# EAGLE design Dist (EAGLE 6.2)
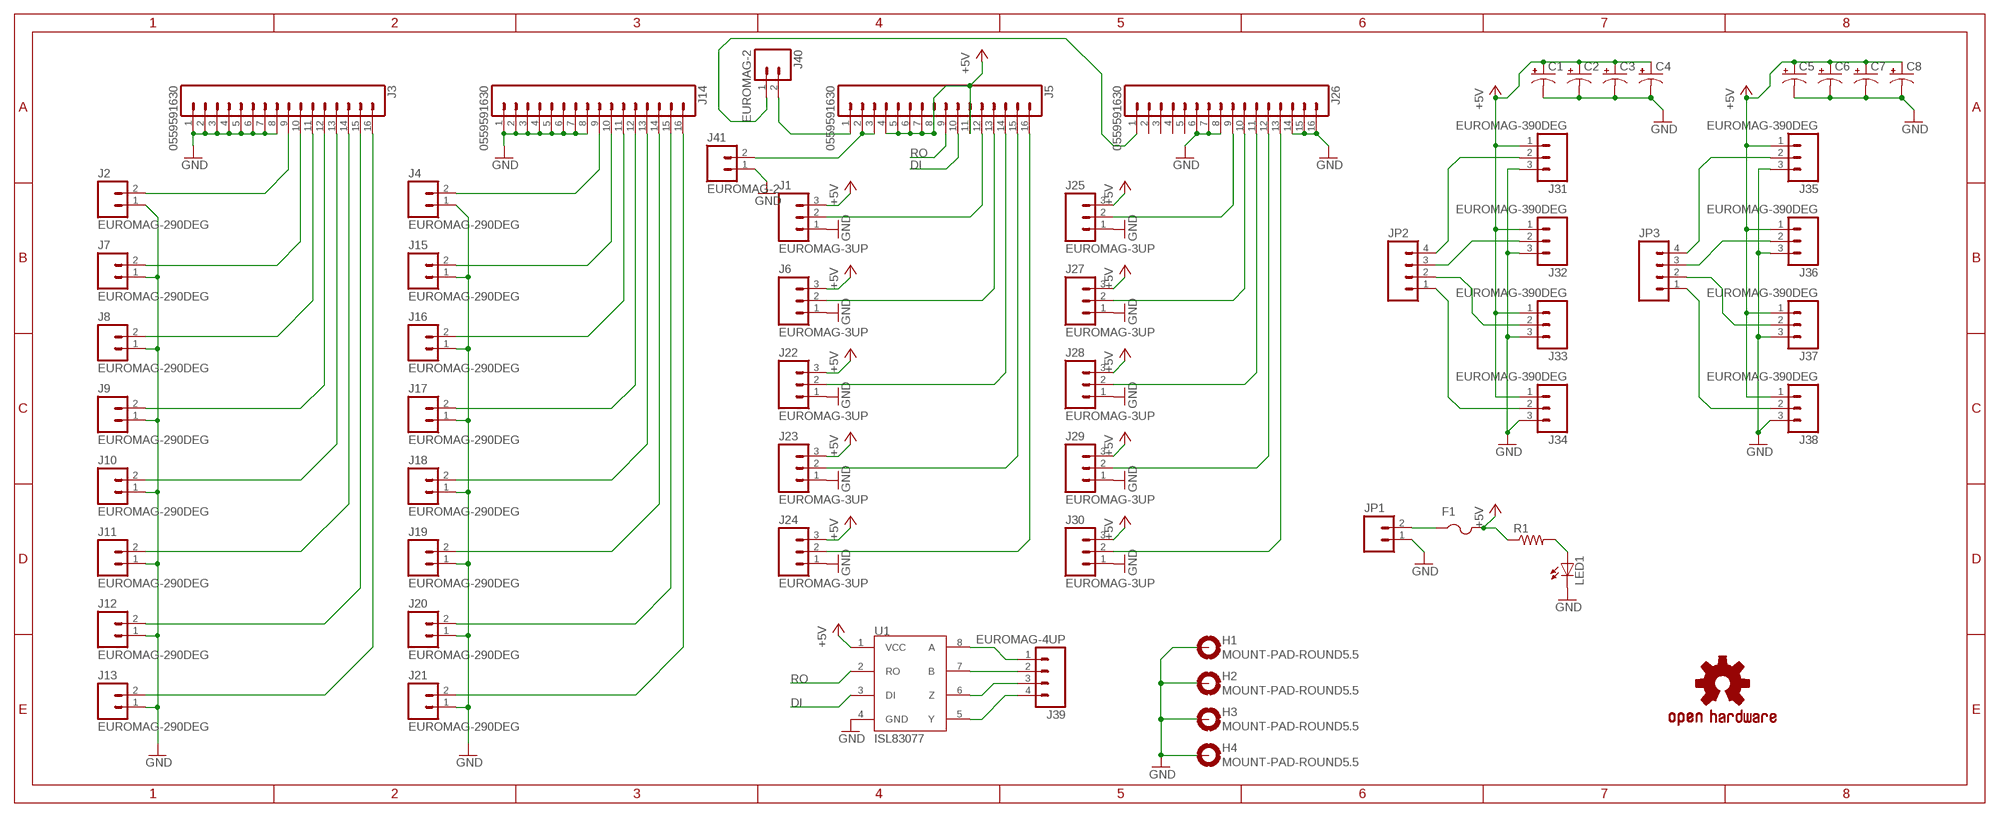
[diagram p0: schematic, sheet 1]

## Parts
C1  CAP_POL3528  [EIA3528]
C2  CAP_POL3528  [EIA3528]
C3  CAP_POL3528  [EIA3528]
C4  CAP_POL3528  [EIA3528]
C5  CAP_POL3528  [EIA3528]
C6  CAP_POL3528  [EIA3528]
C7  CAP_POL3528  [EIA3528]
C8  CAP_POL3528  [EIA3528]
F1  PTCFUSE-1812  [1812]
H1  MOUNT-PAD-ROUND5.5  [5,5-PAD]
H2  MOUNT-PAD-ROUND5.5  [5,5-PAD]
H3  MOUNT-PAD-ROUND5.5  [5,5-PAD]
H4  MOUNT-PAD-ROUND5.5  [5,5-PAD]
J1  EUROMAG-3UP  [M3-UP]
J2  EUROMAG-290DEG  [M2]
J3  0559591630  [0559591630]
J4  EUROMAG-290DEG  [M2]
J5  0559591630  [0559591630]
J6  EUROMAG-3UP  [M3-UP]
J7  EUROMAG-290DEG  [M2]
J8  EUROMAG-290DEG  [M2]
J9  EUROMAG-290DEG  [M2]
J10  EUROMAG-290DEG  [M2]
J11  EUROMAG-290DEG  [M2]
J12  EUROMAG-290DEG  [M2]
J13  EUROMAG-290DEG  [M2]
J14  0559591630  [0559591630]
J15  EUROMAG-290DEG  [M2]
J16  EUROMAG-290DEG  [M2]
J17  EUROMAG-290DEG  [M2]
J18  EUROMAG-290DEG  [M2]
J19  EUROMAG-290DEG  [M2]
J20  EUROMAG-290DEG  [M2]
J21  EUROMAG-290DEG  [M2]
J22  EUROMAG-3UP  [M3-UP]
J23  EUROMAG-3UP  [M3-UP]
J24  EUROMAG-3UP  [M3-UP]
J25  EUROMAG-3UP  [M3-UP]
J26  0559591630  [0559591630]
J27  EUROMAG-3UP  [M3-UP]
J28  EUROMAG-3UP  [M3-UP]
J29  EUROMAG-3UP  [M3-UP]
J30  EUROMAG-3UP  [M3-UP]
J31  EUROMAG-390DEG  [M3]
J32  EUROMAG-390DEG  [M3]
J33  EUROMAG-390DEG  [M3]
J34  EUROMAG-390DEG  [M3]
J35  EUROMAG-390DEG  [M3]
J36  EUROMAG-390DEG  [M3]
J37  EUROMAG-390DEG  [M3]
J38  EUROMAG-390DEG  [M3]
J39  EUROMAG-4UP  [M4-90]
J40  EUROMAG-2  [M2-UP]
J41  EUROMAG-2  [M2-UP]
JP1  M02POLAR_LOCK  [MOLEX-1X2_LOCK]
JP2  M04POLAR_LOCK  [MOLEX-1X4_LOCK]
JP3  M04POLAR_LOCK  [MOLEX-1X4_LOCK]
LED1  LEDCHIPLED_0805  [CHIPLED_0805]
R1  R-US_R0805  [R0805]
U1  ISL83077  [SO08]
U$1  OSHW-LOGOL  [OSHW-LOGO-L]

## Nets
+5V: C1.A(+) C2.A(+) C3.A(+) C4.A(+) C5.A(+) C6.A(+) C7.A(+) C8.A(+) F1.2 J1.3 J5.4 J5.5 J5.6 J5.7 J5.8 J5.11 J6.3 J22.3 J23.3 J24.3 J25.3 J27.3 J28.3 J29.3 J30.3 J31.1 J32.1 J33.1 J34.1 J35.1 J36.1 J37.1 J38.1 R1.1 U1.1(VCC)
DI: J5.10 U1.3(DI)
GND: C1.C(-) C2.C(-) C3.C(-) C4.C(-) C5.C(-) C6.C(-) C7.C(-) C8.C(-) H1.B5,5(MOUNT) H2.B5,5(MOUNT) H3.B5,5(MOUNT) H4.B5,5(MOUNT) J1.1 J2.1 J3.1 J3.2 J3.3 J3.4 J3.5 J3.6 J3.7 J3.8 J4.1 J6.1 J7.1 J8.1 J9.1 J10.1 J11.1 J12.1 J13.1 J14.1 J14.2 J14.3 J14.4 J14.5 J14.6 J14.7 J14.8 J15.1 J16.1 J17.1 J18.1 J19.1 J20.1 J21.1 J22.1 J23.1 J24.1 J25.1 J26.6 J26.7 J26.8 J26.14 J26.15 J26.16 J27.1 J28.1 J29.1 J30.1 J31.3 J32.3 J33.3 J34.3 J35.3 J36.3 J37.3 J38.3 J41.1 JP1.1 LED1.C U1.4(GND)
N$1: J2.2 J3.9
N$2: J3.10 J7.2
N$3: J3.11 J8.2
N$4: J3.12 J9.2
N$5: J3.13 J10.2
N$6: J3.14 J11.2
N$7: J3.15 J12.2
N$8: J3.16 J13.2
N$9: J25.2 J26.9
N$10: J4.2 J14.9
N$11: J14.10 J15.2
N$12: J14.11 J16.2
N$13: J14.12 J17.2
N$14: J14.13 J18.2
N$15: J14.14 J19.2
N$16: J14.15 J20.2
N$17: J14.16 J21.2
N$18: J26.10 J27.2
N$19: J26.11 J28.2
N$20: J26.12 J29.2
N$21: J26.13 J30.2
N$23: J1.2 J5.12
N$24: J5.13 J6.2
N$25: J5.14 J22.2
N$26: J5.15 J23.2
N$27: J5.16 J24.2
N$29: J5.2 J5.3 J41.2
N$30: J5.1 J40.2
N$31: J26.1 J40.1
N$32: J39.1 U1.8(A)
N$33: J39.2 U1.7(B)
N$34: J39.3 U1.6(Z)
N$35: J39.4 U1.5(Y)
N$47: J31.2 JP2.4
N$48: J32.2 JP2.3
N$49: J33.2 JP2.2
N$50: J34.2 JP2.1
N$51: F1.1 JP1.2
N$52: J35.2 JP3.4
N$53: J36.2 JP3.3
N$54: J37.2 JP3.2
N$55: J38.2 JP3.1
N$56: LED1.A R1.2
RO: J5.9 U1.2(RO)
Unconnected: J26.2 J26.3 J26.4 J26.5

## Library data of the parts
C1-C8 = SparkFun:CAP_POL: Capacitor Polarized These are standard SMD and PTH capacitors. Normally 10uF, 47uF, and 100uF in electrolytic and tantalum varieties. Always verify the external diameter of the through hole cap, it varies with capacity, voltage, and manufacturer. The EIA devices should be standard.
F1 = adafruit:PTCFUSE: PTC fuses, resettable thermistors
H1-H4 = holes:MOUNT-PAD-ROUND: MOUNTING PAD, round
J1 J6 J22-J25 J27-J38 = NASA_LIB:EUROMAG-3
J2 J4 J7-J13 J15-J21 J40 J41 = NASA_LIB:EUROMAG-2
J3 J5 J14 J26 = NASA_LIB:0559591630
J39 = NASA_LIB:EUROMAG-4
JP1 = SparkFun:M02: Header 2 Standard 2-pin 0.1" header. Use with straight break away headers (SKU : PRT-00116), right angle break away headers (PRT-00553), swiss pins (PRT-00743), machine pins (PRT-00117), and female headers (PRT-00115). Molex polarized connector foot print use with SKU : PRT-08233 with associated crimp pins and housings.
JP2 JP3 = SparkFun:M04: Header 4 Standard 4-pin 0.1" header. Use with straight break away headers (SKU : PRT-00116), right angle break away headers (PRT-00553), swiss pins (PRT-00743), machine pins (PRT-00117), and female headers (PRT-00115). Molex polarized connector foot print use with SKU : PRT-08231 with associated crimp pins and housings. 1MM SMD Version SKU: PRT-10208
LED1 = adafruit:LED: LED OSRAM: - CHIPLED LG R971, LG N971, LY N971, LG Q971, LY Q971, LO R971, LY R971 LH N974, LH R974 LS Q976, LO Q976, LY Q976 LO Q996 - Hyper CHIPLED LW Q18S LB Q993, LB Q99A, LB R99A - SideLED LS A670, LO A670, LY A670, LG A670, LP A670 LB A673, LV A673, LT A673, LW A673 LH A674 LY A675 LS A676, LA A676, LO A676, LY A676, LW A676 LS A679, LY A679, LG A679 - Hyper Micro SIDELED® LS Y876, LA Y876, LO Y876, LY Y876 LT Y87S - SmartLED LW L88C, LW L88S LB L89C, LB L89S, LG L890 LS L89K, LO L89K, LY L89K LS L896, LA L896, LO L896, LY L896 - TOPLED LS T670, LO T670, LY T670, LG T670, LP T670 LSG T670, LSP T670, LSY T670, LOP T670, LYG T670 LG T671, LOG T671, LSG T671 LB T673, LV T673, LT T673, LW T673 LH T674 LS T676, LA T676, LO T676, LY T676, LB T676, LH T676, LSB T676, LW T676 LB T67C, LV T67C, LT T67C, LS T67K, LO T67K, LY T67K, LW E67C LS E67B, LA E67B, LO E67B, LY E67B, LB E67C, LV E67C, LT E67C LW T67C LS T679, LY T679, LG T679 LS T770, LO T770, LY T770, LG T770, LP T770 LB T773, LV T773, LT T773, LW T773 LH T774 LS E675, LA E675, LY E675, LS T675 LS T776, LA T776, LO T776, LY T776, LB T776 LHGB T686 LT T68C, LB T68C - Hyper Mini TOPLED® LB M676 - Mini TOPLED Santana® LG M470 LS M47K, LO M47K, LY M47K Source: http://www.osram.convergy.de/
R1 = adafruit:R-US_: RESISTOR, American symbol
U1 = NASA_LIB:ISL83077
U$1 = SparkFun:OSHW-LOGO: Open Source Hardware Logo This logo indicates the piece of hardware it is found on incorporates a OSHW license and/or adheres to the definition of open source hardware found here: http://freedomdefined.org/OSHW

## Board
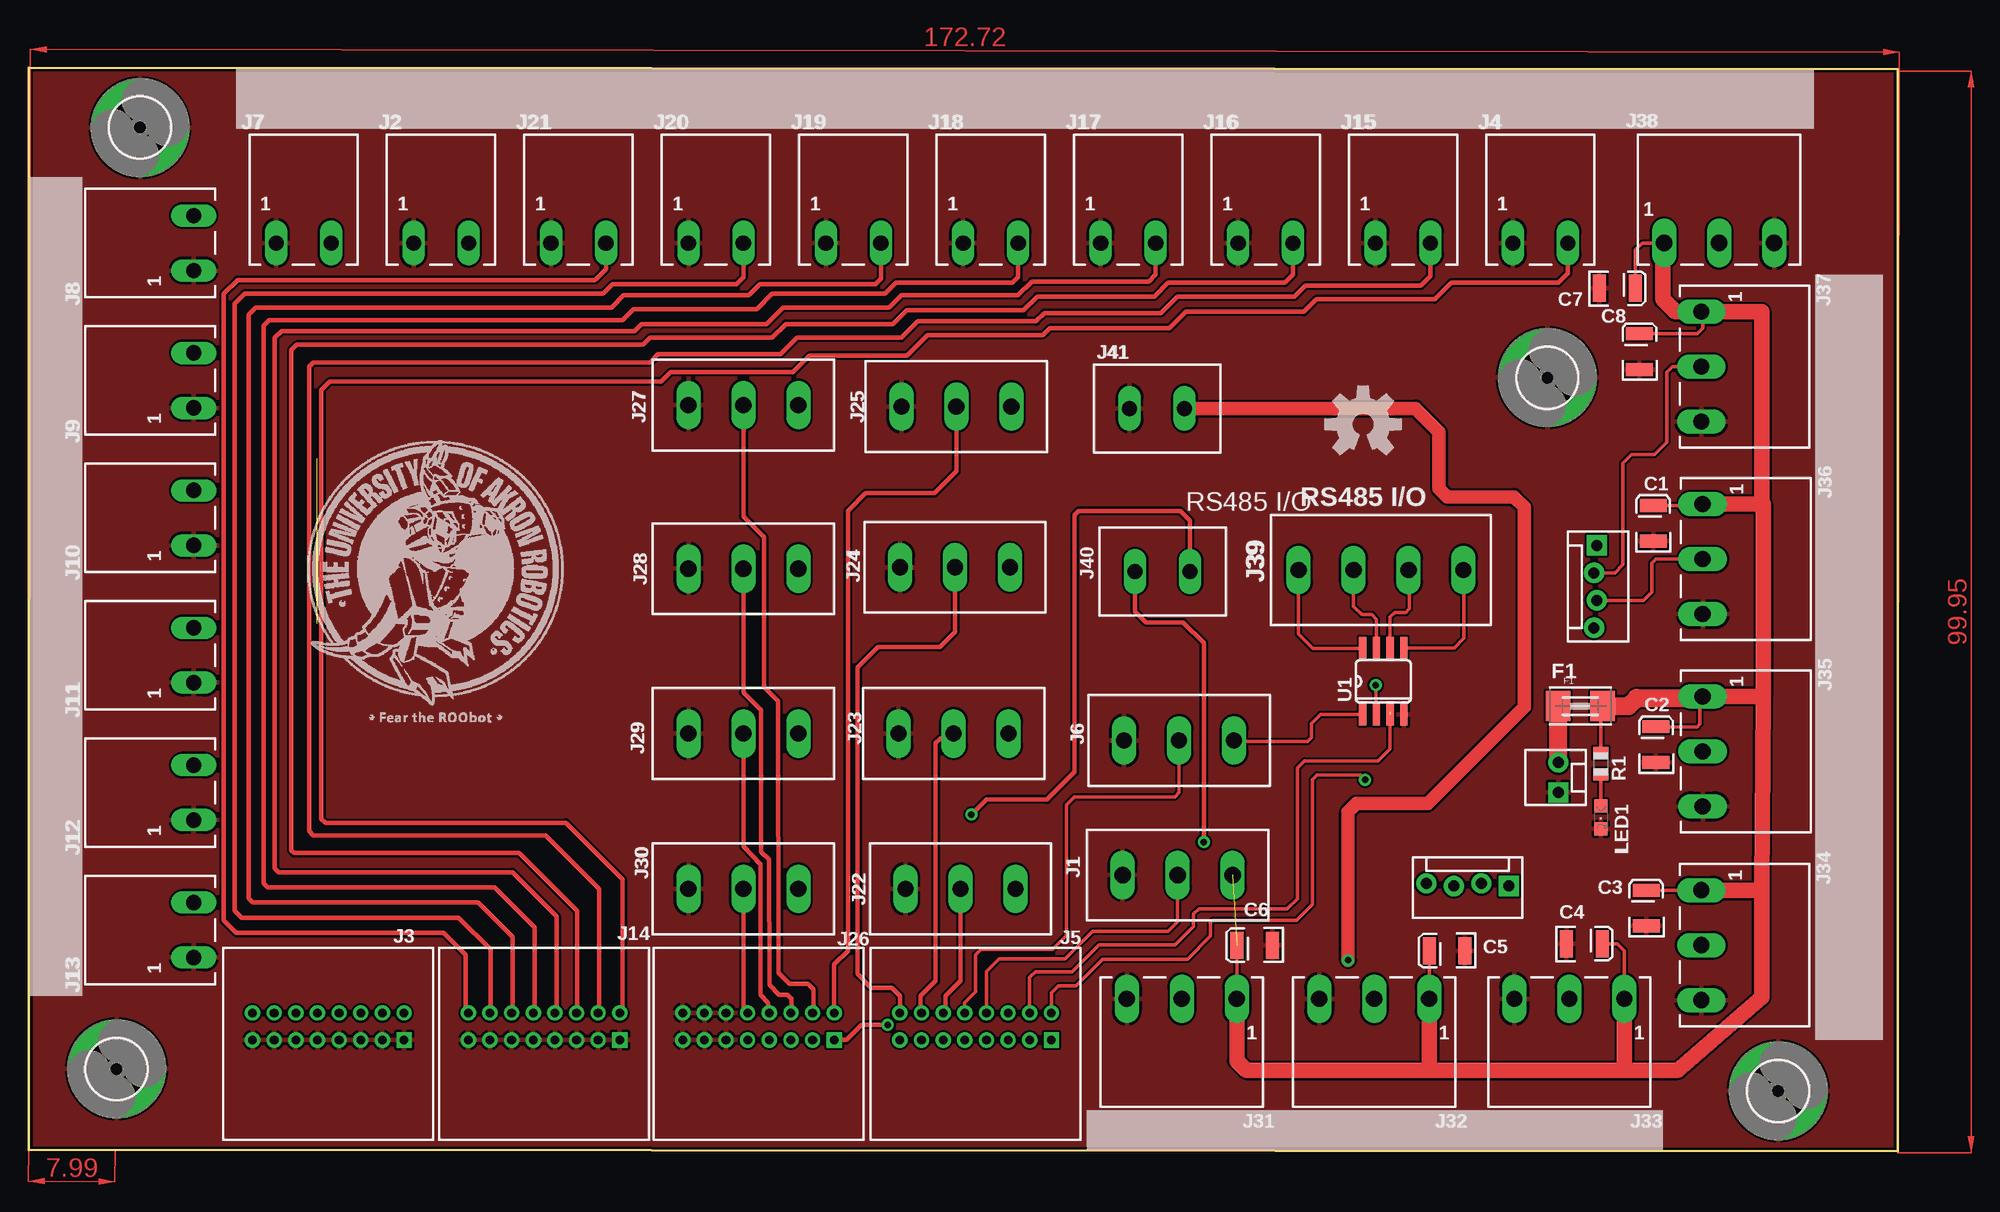
[diagram p1: board, top side]
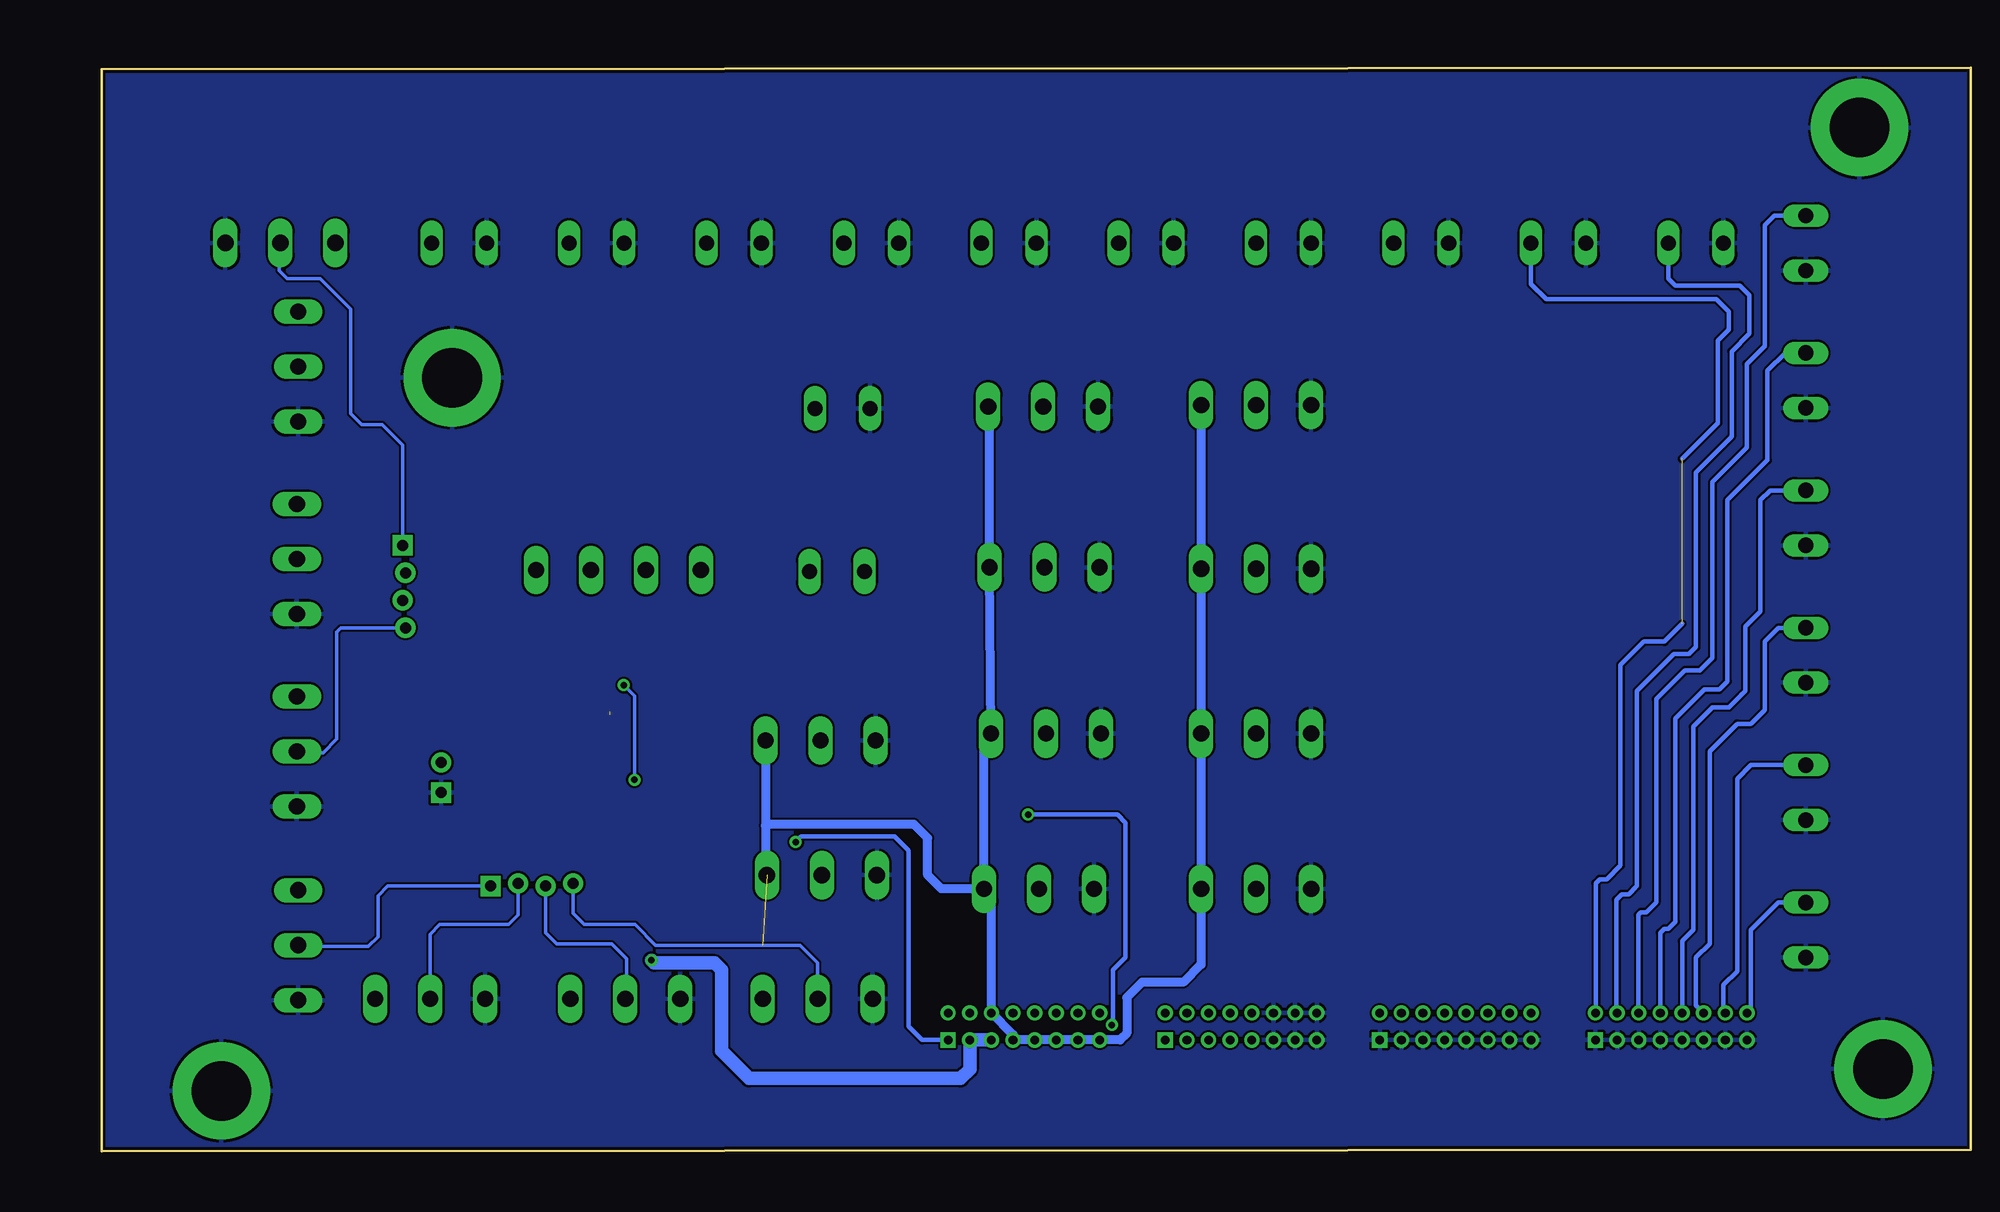
[diagram p2: board, bottom side, seen from below]

Size 172.7 x 100.13 mm. Coordinates in mm from the lower left corner, seen from the top.
Outline: 0,0.13 172.7,0 172.7,100 0,100.13 0,0.13
Copper layers (1*16): Top 0.035mm / dielectric 1.5mm / Bottom 0.035mm
Design rules "default": minimum track width 8mil, minimum drill 20mil, track to track 8mil, track to pad 8mil, pad to pad 8mil, via to via 8mil, smd to smd 8mil, copper to edge 10mil, drill to drill 8mil, minimum pad ring 12mil, minimum via ring 10mil, stop-mask expansion 4mil, vias tented up to drill 25mil, thermal gap 10mil

### Footprints (pad centres in the part's own frame; a part is rotated, then mirrored left to right if it is on the bottom)
EIA3528 = smd 1.2 x 2.5: A 1.65,0; C -1.65,0
1812 = smd 2.286 x 2.794: 1 -2.046,0; 2 2.046,0
5,5-PAD = drill 5.5 pad 9: B5,5 0,0
M3-UP = drill 1.5 long: 1 -5.08,0; 2 0,0; 3 5.08,0
M2 = drill 1.4 long: 1 -2.54,0; 2 2.54,0
0559591630 = drill 0.8 square: 1 -7,0 | drill 0.8: 2 -5,0; 3 -3,0; 4 -1,0; 5 1,0; 6 3,0; 7 5,0; 8 7,0; 9 -7,-2.5; 10 -5,-2.5; 11 -3,-2.5; 12 -1,-2.5; 13 1,-2.5; 14 3,-2.5; 15 5,-2.5; 16 7,-2.5
M3 = drill 1.5 long: 1 -5.08,0; 2 0,0; 3 5.08,0
M4-90 = drill 1.5 long: 1 0,0; 2 5.08,0; 3 10.16,0; 4 15.24,0
M2-UP = drill 1.4 long: 1 -2.54,0; 2 2.54,0
MOLEX-1X2_LOCK = drill 1.016 pad 1.88 square: 1 -0.127,0 | drill 1.016 pad 1.88: 2 2.667,0
MOLEX-1X4_LOCK = drill 1.016 pad 1.88 square: 1 0,0.127 | drill 1.016 pad 1.88: 2 2.54,-0.127; 3 5.08,0.127; 4 7.62,-0.127
CHIPLED_0805 = smd 1.2 x 1.2: A 0,-1.05; C 0,1.05
R0805 = smd 1.1 x 1.4: 1 -1,0; 2 1,0
SO08 = smd 0.66 x 2.032: 1 -1.905,-3.073; 2 -0.635,-3.073; 3 0.635,-3.073; 4 1.905,-3.073; 5 1.905,3.073; 6 0.635,3.073; 7 -0.635,3.073; 8 -1.905,3.073

### Placement (x,y rotation side)
C1  150.11,58.04 90 top
C2  150.37,37.59 90 top
C3  149.48,22.48 90 top
C4  143.76,19.18 0 top
C5  131.06,18.54 180 top
C6  113.28,19.05 180 top
C7  146.81,79.76 0 top
C8  148.84,73.91 90 top
F1  143.38,41.15 0 top
H1  8.13,7.62 0 top
H2  10.29,94.62 0 top
H3  161.67,5.59 0 top
H4  140.33,71.5 0 top
J1  106.17,25.53 0 top
J2  38.1,83.95 0 top
J3  27.69,10.29 180 top
J4  139.7,83.95 0 top
J5  87.5,10.29 180 top
J6  106.3,37.97 0 top
J7  25.4,83.95 0 top
J8  15.24,83.95 90 top
J9  15.24,71.25 90 top
J10  15.24,58.55 90 top
J11  15.24,45.85 90 top
J12  15.24,33.15 90 top
J13  15.24,20.45 90 top
J14  47.62,10.29 180 top
J15  127,83.95 0 top
J16  114.3,83.95 0 top
J17  101.6,83.95 0 top
J18  88.9,83.95 0 top
J19  76.2,83.95 0 top
J20  63.5,83.95 0 top
J21  50.8,83.95 0 top
J22  86.11,24.26 0 top
J23  85.47,38.61 0 top
J24  85.6,53.98 0 top
J25  85.72,68.83 0 top
J26  67.44,10.29 180 top
J27  66.04,68.96 0 top
J28  66.04,53.85 0 top
J29  66.04,38.61 0 top
J30  66.04,24.26 0 top
J31  106.55,14.1 180 top
J32  124.33,14.1 180 top
J33  142.37,14.1 180 top
J34  154.56,19.05 270 top
J35  154.69,36.96 270 top
J36  154.69,54.74 270 top
J37  154.56,72.52 270 top
J38  156.21,83.95 0 top
J39  117.35,53.72 0 top
J40  104.77,53.59 180 top
J41  104.27,68.66 0 top
JP1  141.35,33.27 90 top
JP2  136.78,24.64 180 top
JP3  144.78,56.01 270 top
LED1  145.29,30.86 180 top
R1  145.29,35.81 270 top
U1  125.17,43.43 0 top
U$1  123.32,67.18 0 top
U$2  [ROOBOT1]  24.86,41.23 0 top

### Tracks (layer width: path | path; a pad name or v marks a point on that pad's centre or on a via)
+5V  (1 unrouted)
  Top 0.305: R1.1 145.29,41.01 F1.2 | C6.A J31.1 | C5.A J32.1 | C4.A 146.81,19.18 147.45,18.54 J33.1 | C3.A J34.1 | C2.A 154.18,39.24 154.43,39.5 154.43,41.78 J35.1 | C1.A 154.81,59.69 154.94,59.82 | 150.75,79.76 151,80.01 | C8.A 154.18,75.56 154.69,76.07 154.69,77.47 J37.1 | C7.A 148.46,83.31 149.1,83.95 J38.1 | U1.1 119.38,40.36 118.54,39.52 118.54,38.25 118.16,37.87 111.48,37.87 J6.3
  Top 1.422: J36.1 154.94,59.82 159.89,59.82 | 159.89,59.82 160.27,59.82 160.27,42.04 159.77,42.04 | 159.77,42.04 J35.1 | J34.1 160.15,24.13 160.15,24.39 | 160.15,24.39 160.27,41.91 159.77,42.04 | J31.1 111.63,8.38 112.52,7.49 129.29,7.49 | 129.29,7.49 147.83,7.49 | 147.83,7.49 152.4,7.49 160.15,14.22 160.15,24.01 160.15,24.39 | J33.1 147.45,7.62 147.83,7.49 | J32.1 129.41,7.62 129.29,7.49 | 159.89,59.82 160.15,59.94 160.15,77.6 J37.1 152.15,77.6 151,78.74 151,80.01 151,83.82 J38.1
  Top 1.676: F1.2 147.83,41.15 148.59,41.91 154.56,41.91 J35.1
  Bottom 0.813: J27.3 J28.3 J29.3 J30.3 71.12,17.27 72.77,15.62 76.58,15.62 77.98,14.22 77.98,10.92 78.61,10.29 J5.8 J5.7 J5.6 J5.5 J5.4 88.5,10.79 J5.11 90.5,23.57 J22.3 | J22.3 91.19,37.59 J23.3 J24.3 90.68,67.56 J25.3 | J6.3 111.38,30.1 | 111.38,30.1 111.38,25.65 J1.3 | J22.3 95.12,24.26 96.39,25.53 96.39,28.96 97.66,30.23 111.25,30.23 111.38,30.1
DI  (1 unrouted)
  Top 0.305: J5.10 92.5,16.07 93.01,16.59 96.42,16.59 98.91,19.08 105.92,19.08 107.65,20.8 107.65,21.92 108.13,22.4 116.28,22.4 117.22,23.34 117.22,35.43 117.88,36.09 124.69,36.09 125.78,37.19 125.78,40.61 125.81,40.64
GND
  pour Bottom: 0,0.13 172.72,-0.13 172.72,99.82 0,100.08
  pour Top: 0,0.13 172.59,0.13 172.59,100.08 0,100.08
N$1  (1 unrouted)
  Bottom 0.406: J2.2 40.64,80.14 39.24,78.74 23.49,78.74 22.35,77.6 22.35,75.95 23.37,74.93 23.37,67.31 26.67,64.01 | 26.67,48.77 28.32,47.12 30.23,47.12 32.38,44.96 32.38,26.42 33.65,25.15 34.29,25.15 34.67,24.77 34.67,12.8 J3.9
N$2
  Bottom 0.406: J7.2 27.94,80.65 27.3,80.01 21.34,80.01 20.45,79.12 20.45,75.57 22.1,73.91 22.1,66.04 25.4,62.74 25.4,46.61 26.03,45.97 27.43,45.97 30.86,42.55 30.86,24.51 31.62,23.75 32.26,23.75 32.77,23.24 32.77,12.87 J3.10
N$3
  Bottom 0.406: J8.2 18.16,86.49 19.05,85.6 19.05,74.42 20.7,72.77 20.7,65.02 23.88,61.85 23.88,45.59 25.02,44.45 26.42,44.45 29.08,41.78 29.08,22.99 29.97,22.1 30.48,22.1 30.73,21.84 30.73,12.84 J3.11
N$4
  Bottom 0.406: J9.2 17.14,73.79 18.8,72.14 18.8,63.88 22.48,60.2 22.48,43.43 23.24,42.67 24.64,42.67 27.3,40.01 27.3,21.21 27.94,20.57 28.32,20.57 28.7,20.19 28.7,12.8 J3.12
N$5
  Bottom 0.406: J10.2 18.54,61.09 19.43,60.2 19.43,49.91 20.83,48.51 20.83,42.55 22.35,41.02 23.88,41.02 25.65,39.24 25.65,20.45 26.67,19.43 26.67,12.8 J3.13
N$6
  Bottom 0.406: J11.2 17.78,48.39 19.05,47.12 19.05,40.77 20.32,39.5 21.59,39.5 24.13,36.96 24.13,19.18 25.4,17.91 25.4,13.5 J3.14
N$7
  Bottom 0.406: J12.2 20.32,35.69 21.59,34.42 21.59,16.64 22.86,15.37 22.86,12.96 J3.15
N$8
  Bottom 0.406: J13.2 17.78,22.99 20.32,20.45 20.32,13.15 J3.16
N$9
  Top 0.406: J26.9 74.44,17.29 75.69,18.54 75.69,59.18 77.34,60.83 83.69,60.83 85.72,62.87 J25.2
N$10
  Top 0.406: J4.2 142.24,81.15 141.35,80.26 131.44,80.26 129.92,78.74 119,78.74 117.86,77.6 106.93,77.6 105.41,76.07 94.36,76.07 93.73,75.44 83.06,75.44 81.15,73.53 72.14,73.53 70.61,72.01 59.31,72.01 58.42,71.12 27.81,71.12 27.05,70.36 27.05,30.73 27.43,30.35 49.66,30.35 54.86,25.15 54.86,12.83 54.61,12.57 54.61,12.77 J14.9
N$11
  Top 0.406: J15.2 129.54,80.9 128.65,80.01 117.98,80.01 116.97,78.99 106.17,78.99 104.65,77.47 93.85,77.47 93.09,76.71 82.17,76.71 80.64,75.18 70.99,75.18 69.47,73.66 58.17,73.66 57.4,72.9 26.29,72.9 25.91,72.52 25.91,29.59 26.29,29.21 47.75,29.21 52.7,24.26 52.7,12.7 52.45,12.45 52.45,12.61 J14.10
N$12
  Top 0.406: J16.2 116.84,81.03 116.08,80.26 105.28,80.26 104.01,78.99 93.22,78.99 91.95,77.72 81.15,77.72 79.88,76.45 69.98,76.45 68.71,75.18 57.4,75.18 56.77,74.55 24.76,74.55 24.26,74.04 24.26,27.81 24.51,27.56 45.34,27.56 50.67,22.23 50.67,12.84 J14.11
N$13
  Top 0.406: J17.2 104.14,81.03 103.5,80.39 92.71,80.39 91.44,79.12 80.64,79.12 79.5,77.98 69.72,77.98 68.2,76.45 56.64,76.45 56.01,75.82 23.37,75.82 22.73,75.18 22.73,26.16 23.11,25.78 44.7,25.78 48.77,21.72 48.77,12.93 J14.12
N$14
  Top 0.406: J18.2 91.44,80.77 90.93,80.26 80.14,80.26 79.12,79.25 68.71,79.25 67.31,77.85 55.88,77.85 54.86,76.84 22.22,76.84 21.72,76.33 21.72,24.77 22.1,24.38 43.05,24.38 46.74,20.7 46.74,12.9 J14.13
N$15
  Top 0.406: J19.2 78.74,80.65 78.23,80.14 67.56,80.14 66.55,79.12 54.99,79.12 53.85,77.98 20.95,77.98 20.32,77.34 20.32,23.37 20.7,22.99 41.53,22.99 44.7,19.81 44.7,12.87 J14.14
N$16
  Top 0.406: J20.2 66.04,80.77 65.4,80.14 53.97,80.14 53.09,79.25 19.94,79.25 19.05,78.36 19.05,22.23 19.68,21.59 39.75,21.59 42.67,18.67 42.67,12.83 J14.15
N$17
  Top 0.406: J21.2 53.34,81.53 52.32,80.52 19.3,80.52 18.03,79.25 18.03,21.34 19.18,20.19 38.35,20.19 40.39,18.16 40.39,13.03 J14.16
N$18
  Top 0.406: J27.2 66.04,58.67 67.94,56.77 67.94,42.93 69.27,41.61 69.29,16.51 70.31,15.49 72.01,15.49 72.52,14.99 72.52,12.87 J26.10
N$19
  Top 0.406: J28.2 66.04,42.42 67.69,40.77 67.69,27.69 68.43,26.97 68.45,15.37 69.34,14.48 70.1,14.48 70.48,14.1 70.48,12.84 J26.11
N$20
  Top 0.406: J29.2 66.04,28.19 67.64,26.52 67.64,14.48 68.33,13.72 68.33,12.9 J26.12
N$21
  Top 0.406: J30.2 66.04,13.18 J26.13
N$23
  Top 0.305: J1.2 106.17,21.21 105.28,20.32 98.3,20.32 95.76,17.78 89.66,17.78 88.52,16.64 88.52,12.8 J5.12
N$24
  Top 0.305: J6.2 106.3,33.15 105.92,32.77 96.65,32.77 95.88,32 95.88,19.94 94.61,18.67 88.01,18.67 87.5,18.16 87.5,14.73 86.49,13.72 86.49,12.8 J5.13
N$25
  Top 0.406: J22.2 86.11,15.75 84.71,14.35 84.71,12.99 J5.14
N$26
  Top 0.406: J23.2 84.2,38.1 83.82,37.72 83.82,15.75 82.42,14.35 82.42,12.87 J5.15
N$27
  Top 0.406: J24.2 85.6,48.01 84.2,46.61 78.49,46.61 76.58,44.7 76.58,16.38 77.85,15.11 79.76,15.11 80.52,14.35 80.52,12.8 J5.16
N$29  (via drill 0.6)
  Top 1.27: v121.92,17.65 121.92,31.37 122.68,32.13 129.29,32.13 138.2,41.05 138.2,59.54 137.26,60.48 131.09,60.48 130.33,61.24 130.33,66.47 128.14,68.66 J41.2
  Bottom 1.27: J5.3 J5.2 92.5,7.57 93.34,6.73 112.9,6.73 115.44,9.27 115.44,16.76 116.08,17.4 121.67,17.4 v121.92,17.65
N$30  (via drill 0.6)
  Top 0.406: v108.58,28.58 108.58,46.99 106.68,48.9 103.25,48.9 102.23,49.91 J40.2 102.23,53.98
  Bottom 0.406: J5.1 96.9,10.29 98.17,11.56 98.17,27.81 99.44,29.08 108.08,29.08 v108.58,28.58
N$31  (via drill 0.6)
  Top 0.406: J40.1 107.31,58.29 106.43,59.18 97.03,59.18 96.65,58.8 96.65,35.05 94.11,32.51 88.52,32.51 v87.12,31.12 | v79.37,11.68 76.96,11.68 75.56,10.29 J26.1
  Bottom 0.406: v87.12,31.12 78.87,31.12 78.1,30.35 78.1,17.91 79.25,16.76 79.25,11.81 v79.37,11.68
N$32
  Top 0.305: J39.1 117.35,47.8 118.67,46.48 123.24,46.48 U1.8
N$33
  Top 0.305: J39.2 122.43,50.37 123.19,49.61 124.1,49.61 124.56,49.15 124.56,46.53 U1.7
N$34
  Top 0.305: U1.6 125.81,49.38 126.24,49.81 127.25,49.81 127.61,50.17 127.61,53.62 J39.3
N$35
  Top 0.305: U1.5 131.72,46.51 132.64,47.42 132.64,53.67 J39.4
N$47
  Bottom 0.305: JP2.4 129.16,21.97 128.14,20.96 123.44,20.96 121.54,19.05 108.2,19.05 106.55,17.4 J31.2
N$48
  Bottom 0.305: JP2.3 131.7,20.19 130.68,19.18 125.6,19.18 124.21,17.78 124.21,14.22 J32.2
N$49
  Bottom 0.305: JP2.2 134.24,21.84 135.13,20.96 141.48,20.96 142.37,20.07 142.37,14.22 142.62,13.97 142.49,13.97 J33.2
N$50
  Bottom 0.305: JP2.1 146.3,24.51 147.19,23.62 147.19,19.81 148.08,18.92 154.43,18.92 J34.2
N$51
  Top 1.676: JP1.2 141.35,41.16 | 141.35,41.4 141.35,41.16 | 141.35,41.16 F1.1
N$52
  Bottom 0.305: JP3.4 150.62,48.39 151,48.01 151,38.1 152.27,36.83 154.56,36.83 J35.2
N$53
  Top 0.305: JP3.3 149.22,50.93 149.99,51.69 149.99,54.36 150.37,54.74 J36.2
N$54
  Top 0.305: J37.2 151.89,72.52 151.38,72.01 151.38,65.53 150.24,64.39 148.08,64.39 147.32,63.63 147.32,54.23 146.56,53.47 JP3.2
N$55
  Bottom 0.305: JP3.1 144.91,65.28 146.81,67.18 148.72,67.18 149.73,68.2 149.73,77.85 152.53,80.65 155.57,80.65 156.34,81.41 156.34,83.82 J38.2
N$56
  Top 0.305: R1.2 LED1.A
RO  (via drill 0.6)
  Top 0.305: J5.9 94.5,14.65 95.15,15.29 96.77,15.29 99.21,17.73 107.06,17.73 109.22,19.89 109.22,21.16 109.42,21.36 117.17,21.36 118.62,22.81 118.62,34.37 119.05,34.8 123.04,34.8 v123.49,34.34 | v124.49,43.08 124.49,40.13 124.61,40.01 124.64,40.01 124.64,40.26 U1.2
  Bottom 0.305: v123.49,34.34 123.49,42.09 v124.49,43.08
(copper drawn outside any net)
  shapes: Top area x3

### Text on the board
tPlace: RS485 I/O
_tsilk: J7 | J2 | J21 | J20 | J19 | J18 | J17 | J16 | J15 | J4 | J38 | 1 | 1 | 1 | 1 | 1 | 1 | 1 | 1 | 1 | 1 | 1 | J37 | 1 | C7 | 1 | J8 | C8 | J41 | 1 | J27 | J25 | J9 | J36 | 1 | C1 | RS485 I/O | J40 | 1 | J10 | J28 | J24 | J39 | J35 | F1 | 1 | 1 | U1 | C2 | J23 | J11 | J6 | J29 | R1 | LED1 | 1 | J12 | J34 | J1 | 1 | J30 | C3 | J22 | C4 | C6 | J3 | J14 | J26 | J5 | C5 | 1 | J13 | 1 | 1 | 1 | J31 | J32 | J33